# Altium schematic sheet Peltier_1s.SchDoc: Peltier 1s
size A4; Revision: 1.0; SheetNumber: 11; SheetTotal: 11; Class: B
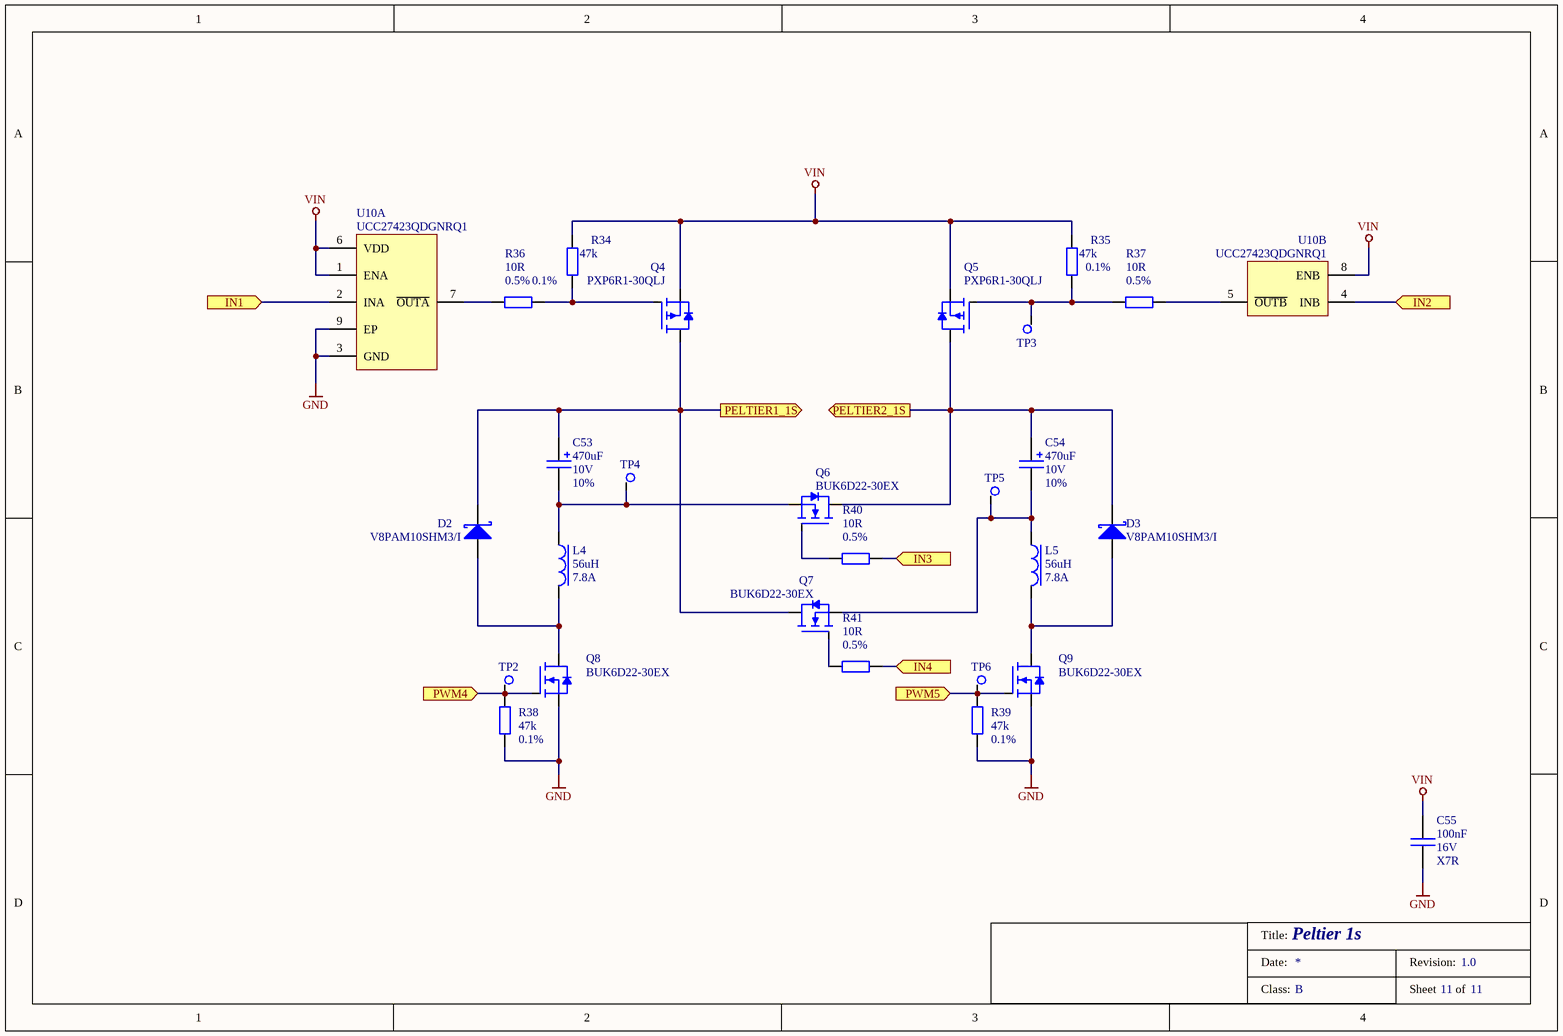
[diagram p0: Peltier_1s.SchDoc]

## Parts
C53  value 470uF  Tolerance: 10%  Voltage: 10V  [CT_X]  (hidden comment: C_Pol)
C54  value 470uF  Tolerance: 10%  Voltage: 10V  [CT_X]  (hidden comment: C_Pol)
C55  value 100nF  Voltage: 16V  Dielectric: X7R  [C_0402]  (hidden comment: C)
D2  value V8PAM10SHM3/I  [D_DO_221BC]  (hidden comment: D_SHOTTKY)
D3  value V8PAM10SHM3/I  [D_DO_221BC]  (hidden comment: D_SHOTTKY)
L4  value 56uH  Max Current: 7.8A  [L_SRP1770]  (hidden comment: L_Core)
L5  value 56uH  Max Current: 7.8A  [L_SRP1770]  (hidden comment: L_Core)
Q4  value PXP6R1-30QLJ  [WDFN_8]  (hidden comment: Q_PMOSFET)
Q5  value PXP6R1-30QLJ  [WDFN_8]  (hidden comment: Q_PMOSFET)
Q6  value BUK6D22-30EX  [SOT_1220]  (hidden comment: Q_NMOSFET)
Q7  value BUK6D22-30EX  [SOT_1220]  (hidden comment: Q_NMOSFET)
Q8  value BUK6D22-30EX  [SOT_1220]  (hidden comment: Q_NMOSFET)
Q9  value BUK6D22-30EX  [SOT_1220]  (hidden comment: Q_NMOSFET)
R34  value 47k  Tolerance: 0.1%  [R_0402]  (hidden comment: R)
R35  value 47k  Tolerance: 0.1%  [R_0402]  (hidden comment: R)
R36  value 10R  Tolerance: 0.5%  [R_0603]  (hidden comment: R)
R37  value 10R  Tolerance: 0.5%  [R_0603]  (hidden comment: R)
R38  value 47k  Tolerance: 0.1%  [R_0402]  (hidden comment: R)
R39  value 47k  Tolerance: 0.1%  [R_0402]  (hidden comment: R)
R40  value 10R  Tolerance: 0.5%  [R_0603]  (hidden comment: R)
R41  value 10R  Tolerance: 0.5%  [R_0603]  (hidden comment: R)
TP2  TP_TestPoint  [TP_01]  (value not drawn)
TP3  TP_TestPoint  [TP_01]  (value not drawn)
TP4  TP_TestPoint  [TP_01]  (value not drawn)
TP5  TP_TestPoint  [TP_01]  (value not drawn)
TP6  TP_TestPoint  [TP_01]  (value not drawn)
U10  value UCC27423QDGNRQ1  [MSOP_8]  (hidden comment: IC_UCC27423_Q1)  (parts A,B of 2)

## Ports
IN1 (in), IN2 (in), IN3 (in), IN4 (in), PELTIER1_1S (out), PELTIER2_1S (out), PWM4 (in), PWM5 (in)

## Nets
GND: C55.2 Q8.2(S) Q9.2(S) R38.2 R39.2 U10.3(GND) U10.9(EP)
VIN: C55.1 Q4.2(S) Q5.2(S) R34.1 R35.1 U10.1(ENA) U10.6(VDD) U10.8(ENB)
IN1: U10.2(INA) ; port IN1
IN2: U10.4(INB) ; port IN2
IN3: R40.2 ; port IN3
IN4: R41.2 ; port IN4
PELTIER1_1S: C53.1 D2.2(K) Q4.3(D) Q7.3(D) ; port PELTIER1_1S
PELTIER2_1S: C54.1 D3.2(K) Q5.3(D) Q6.3(D) ; port PELTIER2_1S
PWM4: Q8.1(G) R38.1 TP2.1 ; port PWM4
PWM5: Q9.1(G) R39.1 TP6.1 ; port PWM5
NetC53_2: C53.2 L4.1 Q6.2(S) TP4.1
NetC54_2: C54.2 L5.1 Q7.2(S) TP5.1
NetD2_1: D2.1(A) L4.2 Q8.3(D)
NetD3_1: D3.1(A) L5.2 Q9.3(D)
NetQ4_1: Q4.1(G) R34.2 R36.2
NetQ5_1: Q5.1(G) R35.2 R37.1 TP3.1
NetQ6_1: Q6.1(G) R40.1
NetQ7_1: Q7.1(G) R41.1
NetR36_1: R36.1 U10.7(~{OUTA})
NetR37_2: R37.2 U10.5(~{OUTB})

## Notes on the sheet
- Title:
- Date:
- Revision:
- Class:
- Sheet
- of

## Library data of the parts
C53 C54 = CT_470uF_10V_X: Manufacturer: Kemet; Manufacturer Part Number: T491X477K010AT; ESR: 200mR; RMS Power: 165mW; Tmax: 125; Tmin: -55; Grade: 1; Fail Rate: B; Part Number: CT_470uF_10V_X; HelpURL: https://connect.kemet.com:7667/gateway/IntelliData-ComponentDocumentation/1.0/download/datasheet/T491X477K010AT; Supplier 1: Mouser; Supplier Part Number 1: 80-T491X477K010; Status: Active
C55 = C_100nF_16V_0402: Capacitor; Manufacturer: Kemet; Manufacturer Part Number: C0402T104K4RAC7867; Tmax: 125; Tmin: -55; Grade: 2; Fail Rate: A; Tolerance: 10%; Part Number: C_100nF_16V_0402; HelpURL: https://api.kemet.com/component-edge/download/specsheet/C0402T104K4RACTU.pdf; Supplier 2: Mouser; Supplier Part Number 2: 80-C0402T104K4RACTU; Supplier 1: Digi-Key; Supplier Part Number 1: 399-17387-1-ND; Status: Active
D2 D3 = V8PAM10SHM3/I: Surface-Mount TMBS (Trench MOS Barrier Schottky) Rectifier; Manufacturer: Vishay; Reverse voltage: 100V; Forward current: 8A; Tmax: 175; Tmin: -40; Grade: 2; Part Number: V8PAM10SHM3/I; HelpURL: https://www.vishay.com/docs/87013/v8pam10s.pdf; Manufacturer Part Number: V8PAM10SHM3/I; Supplier 1: Mouser; Supplier Part Number 1: 78-V8PAM10SHM3/I; Status: Active
L4 L5 = SRP1770TA-560M: Shielded automotive Inductors, High Temperature; Manufacturer: Bourns; ESR: 62mR; Tmax: 150; Tmin: -40; Grade: 2; Tolerance: 20%; Part Number: SRP1770TA-560M; HelpURL: https://www.bourns.com/docs/Product-Datasheets/SRP1770TA.pdf; Manufacturer Part Number: SRP1770TA-560M; Supplier 1: Mouser; Supplier Part Number 1: 652-SRP1770TA-560M; Status: Active
Q4 Q5 = PXP6R1-30QLJ: Low Vgs Single P-Channel; Manufacturer: NEXPERIA; Max Power Dissipation: 50W; Tmax: 150; Tmin: -55; Grade: 2; Part Number: PXP6R1-30QLJ; HelpURL: https://assets.nexperia.com/documents/data-sheet/PXP6R1-30QL.pdf; Manufacturer Part Number: PXP6R1-30QLJ; Supplier 1: Mouser; Supplier Part Number 1: 771-PXP6R1-30QLJ; Status: Active
Q6-Q9 = BUK6D22-30EX: Automotive N-Channel 30 V, Low Vgs Treshold; Manufacturer: NEXPERIA; Max Power Dissipation: 19W; Tmax: 175; Tmin: -55; Grade: 2; Part Number: BUK6D22-30EX; HelpURL: https://assets.nexperia.com/documents/data-sheet/BUK6D22-30E.pdf; Manufacturer Part Number: BUK6D22-30EX; Supplier 1: Mouser; Supplier Part Number 1: 771-BUK6D22-30EX; Status: Active
R34 R35 R38 R39 = R_47k_50V_0402: Manufacturer: Vishay; Manufacturer Part Number: MCS0402MD4702BE100; Voltage: 50V; RMS Power: 0.1W; TCR: 25ppm; Tmax: 155; Tmin: -55; Grade: 2; Part Number: R_47k_50V_0402; HelpURL: https://www.vishay.com/docs/28785/mcat_pre.pdf; Supplier 2: Mouser; Supplier Part Number 2: 594-MCS0402MD4702BE1; Supplier 1: Digi-Key; Supplier Part Number 1: MCS0402-47.0K-MBCT-ND; Status: Active
R36 R37 R40 R41 = R_10R_75V_0603: Manufacturer: Vishay; Manufacturer Part Number: MCT0603PD1009DP500; Voltage: 75V; RMS Power: 0.25W; TCR: 25ppm; Tmax: 175; Tmin: -55; Grade: 2; Part Number: R_10R_75V_0603; HelpURL: https://www.vishay.com/docs/28916/mcxhp.pdf; Supplier 2: Mouser; Supplier Part Number 2: 594-MCT0603PD1009DP5; Supplier 1: Digi-Key; Supplier Part Number 1: 749-1520-1-ND; Status: Active
TP2-TP6 = TestPoint1: Manufacturer: Progresja Space; Value: TP; Grade: 3; Part Number: TestPoint1; Status: Active
U10 = UCC27423: Dual 4-A High-Speed Low-Side MOSFET Drivers With Enable; Manufacturer: TI; Tmax: 125; Tmin: -40; Grade: 2; Part Number: UCC27423; HelpURL: https://www.ti.com/lit/ds/symlink/ucc27423-q1.pdf?HQS=dis-mous-null-mousermode-dsf-pf-null-wwe&ts=1651498832882&ref_url=https%253A%252F%252Fwww.mouser.pl%252F; Manufacturer Part Number: UCC27423QDGNRQ1; Supplier 1: Mouser; Supplier Part Number 1: 595-UCC27423QDGNRQ1; Status: Active